# Altium schematic sheet Gigabit_Ethernet.SchDoc: Gigabit Ethernet
size A3; DrawnBy: Emre Can Damyanlı; Revision: A.1; SheetNumber: 9; SheetTotal: 9; ENG_APP_DATE: --/--/--; DSN_APP_DATE: --/--/--; CHK_APP_DATE: --/--/--
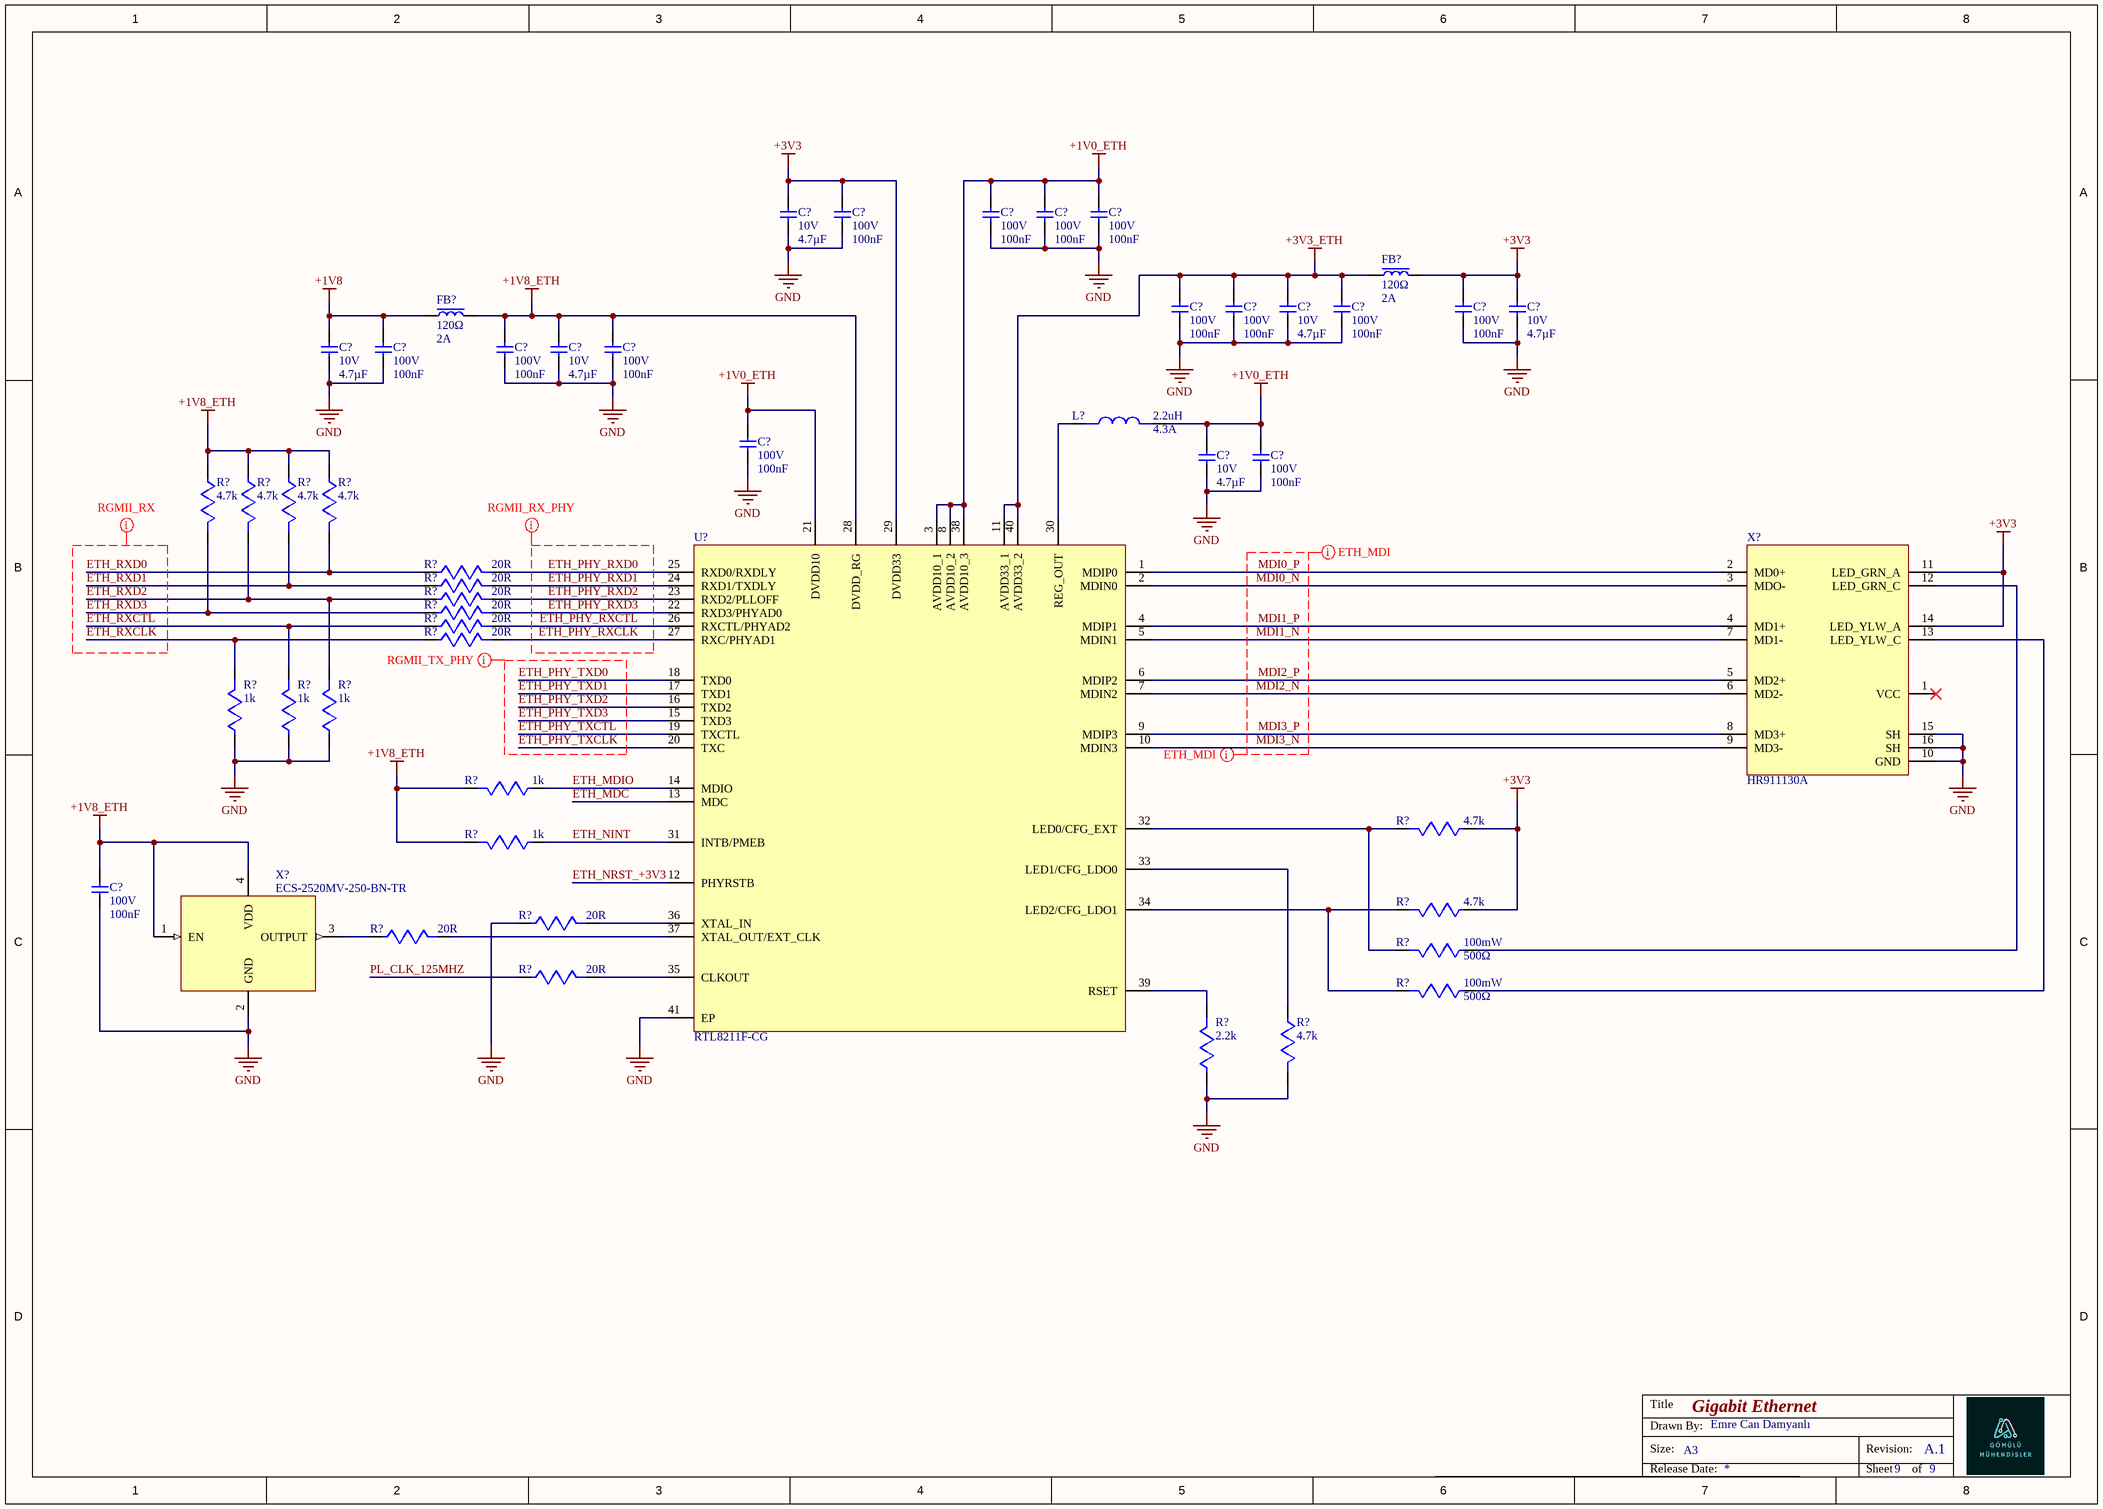
[diagram p0: Gigabit_Ethernet.SchDoc]

## Parts
(Parts that share a designator on the sheet are numbered #1, #2 ... from top to bottom, then left to right.)
C?#1  value 100nF  Voltage Rating: 100V  [CAPC1608X94N]  (hidden comment: GCJ188R72A104KA01D)
C?#2  value 100nF  Voltage Rating: 100V  [CAPC1608X94N]  (hidden comment: GCJ188R72A104KA01D)
C?#3  value 100nF  Voltage Rating: 100V  [CAPC1608X94N]  (hidden comment: GCJ188R72A104KA01D)
C?#4  value 100nF  Voltage Rating: 100V  [CAPC1608X94N]  (hidden comment: GCJ188R72A104KA01D)
C?#5  value 4.7µF  Voltage Rating: 10V  [CAPC1005X55N]  (hidden comment: CL05A475MP5NRNC)
C?#6  value 100nF  Voltage Rating: 100V  [CAPC1608X94N]  (hidden comment: GCJ188R72A104KA01D)
C?#7  value 100nF  Voltage Rating: 100V  [CAPC1608X94N]  (hidden comment: GCJ188R72A104KA01D)
C?#8  value 100nF  Voltage Rating: 100V  [CAPC1608X94N]  (hidden comment: GCJ188R72A104KA01D)
C?#9  value 100nF  Voltage Rating: 100V  [CAPC1608X94N]  (hidden comment: GCJ188R72A104KA01D)
C?#10  value 4.7µF  Voltage Rating: 10V  [CAPC1005X55N]  (hidden comment: CL05A475MP5NRNC)
C?#11  value 4.7µF  Voltage Rating: 10V  [CAPC1005X55N]  (hidden comment: CL05A475MP5NRNC)
C?#12  value 100nF  Voltage Rating: 100V  [CAPC1608X94N]  (hidden comment: GCJ188R72A104KA01D)
C?#13  value 100nF  Voltage Rating: 100V  [CAPC1608X94N]  (hidden comment: GCJ188R72A104KA01D)
C?#14  value 100nF  Voltage Rating: 100V  [CAPC1608X94N]  (hidden comment: GCJ188R72A104KA01D)
C?#15  value 4.7µF  Voltage Rating: 10V  [CAPC1005X55N]  (hidden comment: CL05A475MP5NRNC)
C?#16  value 4.7µF  Voltage Rating: 10V  [CAPC1005X55N]  (hidden comment: CL05A475MP5NRNC)
C?#17  value 100nF  Voltage Rating: 100V  [CAPC1608X94N]  (hidden comment: GCJ188R72A104KA01D)
C?#18  value 100nF  Voltage Rating: 100V  [CAPC1608X94N]  (hidden comment: GCJ188R72A104KA01D)
C?#19  value 4.7µF  Voltage Rating: 10V  [CAPC1005X55N]  (hidden comment: CL05A475MP5NRNC)
C?#20  value 100nF  Voltage Rating: 100V  [CAPC1608X94N]  (hidden comment: GCJ188R72A104KA01D)
FB?#1  Impedance: 120Ω  Max Current Rating: 2A  [FERRITE_0402]  (hidden comment: BLM15PX121SN1D)
FB?#2  Impedance: 120Ω  Max Current Rating: 2A  [FERRITE_0402]  (hidden comment: BLM15PX121SN1D)
L?  value 2.2uH  RMS Current (Irms): 4.3A  [PA4332.XXXNLT]  (hidden comment: PA4332.222NLT)
R?#1  value 4.7k  [RESISTOR_0603]  (hidden comment: RC0603FR-074K7L)
R?#2  value 4.7k  [RESISTOR_0603]  (hidden comment: RC0603FR-074K7L)
R?#3  value 4.7k  [RESISTOR_0603]  (hidden comment: RC0603FR-074K7L)
R?#4  value 4.7k  [RESISTOR_0603]  (hidden comment: RC0603FR-074K7L)
R?#5  value 20R  (hidden comment: RC0603FR-0720RL)
R?#6  value 20R  (hidden comment: RC0603FR-0720RL)
R?#7  value 20R  (hidden comment: RC0603FR-0720RL)
R?#8  value 20R  (hidden comment: RC0603FR-0720RL)
R?#9  value 20R  (hidden comment: RC0603FR-0720RL)
R?#10  value 20R  (hidden comment: RC0603FR-0720RL)
R?#11  value 1k  [RESISTOR_0603]  (hidden comment: RC0603FR-071KL)
R?#12  value 1k  [RESISTOR_0603]  (hidden comment: RC0603FR-071KL)
R?#13  value 1k  [RESISTOR_0603]  (hidden comment: RC0603FR-071KL)
R?#14  value 1k  [RESISTOR_0603]  (hidden comment: RC0603FR-071KL)
R?#15  value 4.7k  [RESISTOR_0603]  (hidden comment: RC0603FR-074K7L)
R?#16  value 1k  [RESISTOR_0603]  (hidden comment: RC0603FR-071KL)
R?#17  value 4.7k  [RESISTOR_0603]  (hidden comment: RC0603FR-074K7L)
R?#18  value 20R  (hidden comment: RC0603FR-0720RL)
R?#19  value 20R  (hidden comment: RC0603FR-0720RL)
R?#20  value 500Ω  Power Rating: 100mW  [RESISTOR_0603]  (hidden comment: RT0603BRC07500RL)
R?#21  value 20R  (hidden comment: RC0603FR-0720RL)
R?#22  value 500Ω  Power Rating: 100mW  [RESISTOR_0603]  (hidden comment: RT0603BRC07500RL)
R?#23  value 2.2k  [RESISTOR_0603]  (hidden comment: RC0603FR-072K2L)
R?#24  value 4.7k  [RESISTOR_0603]  (hidden comment: RC0603FR-074K7L)
U?  RTL8211F-CG  [QFN40P500X500X90-41N-D]
X?#1  HR911130A  [HR911130A]
X?#2  ECS-2520MV-250-BN-TR  [OSCCC250X200X90N]

## Nets
+1V0_ETH: C?#2.2 C?#3.2 C?#4.2 C?#17.2 C?#18.2 C?#19.2 L?.2 U?.3(AVDD10_1) U?.8(AVDD10_2) U?.21(DVDD10) U?.38(AVDD10_3)
+1V8: C?#12.2 C?#15.2 FB?#2.1
+1V8_ETH: C?#13.2 C?#14.2 C?#16.2 C?#20.2 FB?#2.2 R?#1.1 R?#2.1 R?#3.1 R?#4.1 R?#14.2 R?#16.2 U?.28(DVDD_RG) X?#2.1(EN) X?#2.4(VDD)
+3V3: C?#1.2 C?#5.2 C?#9.2 C?#11.2 FB?#1.1 R?#15.1 R?#17.1 U?.29(DVDD33) X?#1.11(LED_GRN_A) X?#1.14(LED_YLW_A)
+3V3_ETH: C?#6.2 C?#7.2 C?#8.2 C?#10.2 FB?#1.2 U?.11(AVDD33_1) U?.40(AVDD33_2)
GND: C?#1.1 C?#2.1 C?#3.1 C?#4.1 C?#5.1 C?#6.1 C?#7.1 C?#8.1 C?#9.1 C?#10.1 C?#11.1 C?#12.1 C?#13.1 C?#14.1 C?#15.1 C?#16.1 C?#17.1 C?#18.1 C?#19.1 C?#20.1 R?#11.1 R?#12.1 R?#13.1 R?#18.1 R?#23.1 R?#24.2 U?.41(EP) X?#1.10(GND) X?#1.15(SH) X?#1.16(SH) X?#2.2(GND)
ETH_MDC: U?.13(MDC)
ETH_MDIO: R?#14.1 U?.14(MDIO)
ETH_NINT: R?#16.1 U?.31(INTB/PMEB)
ETH_NRST_+3V3: U?.12(PHYRSTB)
ETH_PHY_RXCLK: R?#10.2 U?.27(RXC/PHYAD1)
ETH_PHY_RXCTL: R?#9.2 U?.26(RXCTL/PHYAD2)
ETH_PHY_RXD0: R?#5.2 U?.25(RXD0/RXDLY)
ETH_PHY_RXD1: R?#6.2 U?.24(RXD1/TXDLY)
ETH_PHY_RXD2: R?#7.2 U?.23(RXD2/PLLOFF)
ETH_PHY_RXD3: R?#8.2 U?.22(RXD3/PHYAD0)
ETH_PHY_TXCLK: U?.20(TXC)
ETH_PHY_TXCTL: U?.19(TXCTL)
ETH_PHY_TXD0: U?.18(TXD0)
ETH_PHY_TXD1: U?.17(TXD1)
ETH_PHY_TXD2: U?.16(TXD2)
ETH_PHY_TXD3: U?.15(TXD3)
ETH_RXCLK: R?#10.1 R?#11.2
ETH_RXCTL: R?#9.1 R?#12.2
ETH_RXD0: R?#4.2 R?#5.1
ETH_RXD1: R?#3.2 R?#6.1
ETH_RXD2: R?#2.2 R?#7.1 R?#13.2
ETH_RXD3: R?#1.2 R?#8.1
MDI0_N: U?.2(MDIN0) X?#1.3(MDO-)
MDI0_P: U?.1(MDIP0) X?#1.2(MD0+)
MDI1_N: U?.5(MDIN1) X?#1.7(MD1-)
MDI1_P: U?.4(MDIP1) X?#1.4(MD1+)
MDI2_N: U?.7(MDIN2) X?#1.6(MD2-)
MDI2_P: U?.6(MDIP2) X?#1.5(MD2+)
MDI3_N: U?.10(MDIN3) X?#1.9(MD3-)
MDI3_P: U?.9(MDIP3) X?#1.8(MD3+)
PL_CLK_125MHZ: R?#21.1
NetL?_1: L?.1 U?.30(REG_OUT)
NetR?#15_2: R?#15.2 R?#20.2 U?.32(LED0/CFG_EXT)
NetR?#17_2: R?#17.2 R?#22.2 U?.34(LED2/CFG_LDO1)
NetR?#18_2: R?#18.2 U?.36(XTAL_IN)
NetR?#19_1: R?#19.1 X?#2.3(OUTPUT)
NetR?#19_2: R?#19.2 U?.37(XTAL_OUT/EXT_CLK)
NetR?#20_1: R?#20.1 X?#1.12(LED_GRN_C)
NetR?#21_2: R?#21.2 U?.35(CLKOUT)
NetR?#22_1: R?#22.1 X?#1.13(LED_YLW_C)
NetR?#23_2: R?#23.2 U?.39(RSET)
NetR?#24_1: R?#24.1 U?.33(LED1/CFG_LDO0)

Not connected (* = marked no-connect by the designer): X?#1 1(VCC)*

## Layout directives
mark named ETH_MDI: MDI0_N, MDI0_P, MDI1_N, MDI1_P, MDI2_N, MDI2_P, MDI3_N, MDI3_P
differential pair: MDI0_N, MDI0_P, MDI1_N, MDI1_P, MDI2_N, MDI2_P, MDI3_N, MDI3_P
mark named RGMII_RX: ETH_RXCLK, ETH_RXCTL, ETH_RXD0, ETH_RXD1, ETH_RXD2, ETH_RXD3
mark named RGMII_RX_PHY: ETH_PHY_RXCLK, ETH_PHY_RXCTL, ETH_PHY_RXD0, ETH_PHY_RXD1, ETH_PHY_RXD2, ETH_PHY_RXD3
mark named RGMII_TX_PHY: ETH_PHY_TXCLK, ETH_PHY_TXCTL, ETH_PHY_TXD0, ETH_PHY_TXD1, ETH_PHY_TXD2, ETH_PHY_TXD3

## Notes on the sheet
- Title
- Size:
- Drawn By:
- A3
- Revision:
- Release Date:
- Sheet
- of

## Library data of the parts
C?#1-C?#4 C?#6-C?#9 C?#12-C?#14 C?#17 C?#18 C?#20 = GCJ188R72A104KA01D: Cap Ceramic 0.1uF 100V X7R 10% Pad SMD 0603 Soft Termination 125C Automotive T/R; Manufacturer: Murata; Material: 4241ConductorMaterial; Supplier: Digikey; Supplier Part Number: 490-13420-1-ND; Manufacturer Part Number: GCJ188R72A104KA01D; RoHS: Yes; Category: Ceramic Capacitors; Stock: 681954; Pricing: 1=0,19, 10=0,123, 50=0,0774, 100=0,0619, 500=0,04472, 1000=0,03956 (USD); Mounting Technology: Surface Mount; Case/Package: 0603; Case Code (Metric): 1608; Case Code (Imperial): 0603; Min Operating Temperature: -55°C; Max Operating Temperature: 125°C; Packaging: Cut Tape; Tolerance: 10%; Features: Soft Termination; Series: GCJ; Length: 0.063inch; Width: 0.031inch; Height: 900um; Thickness: 0.035inch; Ratings: AEC-Q200; RoHS Compliant: Yes; Lead Free: 5697LeadFree; ComponentLink1URL: https://datasheet.octopart.com/GCJ188R72A104KA01D-Murata-datasheet-78375067.pdf?src-supplier=Future+Electronics; ComponentLink1Description: https://datasheet.octopart.com/GCJ188R72A104KA01D-Murata-datasheet-78375067.pdf?src-supplier=Future+Electronics; ComponentLink2URL: http://search.murata.co.jp/Ceramy/image/img/A01X/partnumbering_e_02.pdf?src-supplier=Digikey; ComponentLink2Description: http://search.murata.co.jp/Ceramy/image/img/A01X/partnumbering_e_02.pdf?src-supplier=Digikey; ComponentLink3URL: https://www.murata.com/~/media/webrenewal/support/library/catalog/products/capacitor/mlcc/c03e.ashx?la=en-us&src-supplier=Digikey; ComponentLink3Description: https://www.murata.com/~/media/webrenewal/support/library/catalog/products/capacitor/mlcc/c03e.ashx?la=en-us&src-supplier=Digikey; ComponentLink4URL: https://datasheet.octopart.com/GCJ188R72A104KA01D-Murata-datasheet-165611796.pdf?src-supplier=TME; ComponentLink4Description: https://datasheet.octopart.com/GCJ188R72A104KA01D-Murata-datasheet-165611796.pdf?src-supplier=TME
C?#5 C?#10 C?#11 C?#15 C?#16 C?#19 = CL05A475MP5NRNC: Ceramic Capacitor, Multilayer, Ceramic, 10V, 20% +Tol, 20% -Tol, X5R, +-15% TC, 4.7uF, Surface Mount, 0402 inch; Manufacturer: Samsung Electro-Mechanics; Supplier: Avnet; Supplier Part Number: CL05A475MP5NRNC; Manufacturer Part Number: CL05A475MP5NRNC; RoHS: Compliant; Category: Ceramic Capacitors; Stock: 40000; Pricing: 10000=0,00671, 20000=0,00663, 40000=0,0066, 80000=0,00656, 160000=0,00653 (USD); Case/Package: 0402; Case Code (Imperial): 0402; Case Code (Metric): 1005; China RoHS: Compliant; Dielectric: X5R; Dielectric Material: Ceramic; Height: 500µm; Lead Free: Lead Free; Length: 1mm; Lifecycle Status: Production; Material: Ceramic; Max Operating Temperature: 85°C; Min Operating Temperature: -55°C; Mounting Technology: Surface Mount; Number of Terminals: 2; REACH SVHC: Yes; Schedule B: 8532240020, 8532240020|8532240020|8532240020|8532240020|8532240020|8532240020|8532240020|8532240020|8532240020|8532240020|8532240020|8532240020|8532240020|8532240020|8532240020|8532240020|8532240020|8532240020|8532240020|8532240020|8532240020|8532240020, 8532240020|8532240020|8532240020|8532240020|8532240020|8532240020|8532240020|8532240020|8532240020|8532240020|8532240020|8532240020|8532240020|8532240020|8532240020|8532240020|8532240020|8532240020|8532240020|8532240020|8532240020|8532240020|8532240020, 8532240020|8532240020|8532240020|8532240020|8532240020|8532240020|8532240020|8532240020|8532240020|8532240020|8532240020|8532240020|8532240020|8532240020|8532240020|8532240020|8532240020|8532240020|8532240020|8532240020|8532240020|8532240020|8532240020|85; Thickness: 558.8µm; Tolerance: 20%; Voltage Rating (DC): 10V; Width: 500µm; ComponentLink1URL: https://datasheet.octopart.com:443/CL05A475MP5NRNC-Samsung-Electro-Mechanics-datasheet-181551186.pdf?src-supplier=Newark; ComponentLink1Description: https://datasheet.octopart.com:443/CL05A475MP5NRNC-Samsung-Electro-Mechanics-datasheet-181551186.pdf?src-supplier=Newark; ComponentLink2URL: https://datasheet.octopart.com:443/CL05A475MP5NRNC-Samsung-Electro-Mechanics-datasheet-136482298.pdf?src-supplier=Newark; ComponentLink2Description: https://datasheet.octopart.com:443/CL05A475MP5NRNC-Samsung-Electro-Mechanics-datasheet-136482298.pdf?src-supplier=Newark; ComponentLink3URL: https://datasheet.octopart.com:443/CL05A475MP5NRNC-Samsung-Electro-Mechanics-datasheet-136031736.pdf?src-supplier=Future+Electronics; ComponentLink3Description: https://datasheet.octopart.com:443/CL05A475MP5NRNC-Samsung-Electro-Mechanics-datasheet-136031736.pdf?src-supplier=Future+Electronics; ComponentLink4URL: https://datasheet.octopart.com:443/CL05A475MP5NRNC-Samsung-Electro-Mechanics-datasheet-110226226.pdf?src-supplier=Future+Electronics; ComponentLink4Description: https://datasheet.octopart.com:443/CL05A475MP5NRNC-Samsung-Electro-Mechanics-datasheet-110226226.pdf?src-supplier=Future+Electronics; ComponentLink5URL: https://datasheet.octopart.com:443/CL05A475MP5NRNC-Samsung-Electro-Mechanics-datasheet-87580058.pdf?src-supplier=Future+Electronics; ComponentLink5Description: https://datasheet.octopart.com:443/CL05A475MP5NRNC-Samsung-Electro-Mechanics-datasheet-87580058.pdf?src-supplier=Future+Electronics; ComponentLink6URL: https://datasheet.octopart.com:443/CL05A475MP5NRNC-Samsung-Electro-Mechanics-datasheet-81461611.pdf?src-supplier=Future+Electronics; ComponentLink6Description: https://datasheet.octopart.com:443/CL05A475MP5NRNC-Samsung-Electro-Mechanics-datasheet-81461611.pdf?src-supplier=Future+Electronics; ComponentLink7URL: https://datasheet.octopart.com:443/CL05A475MP5NRNC-Samsung-datasheet-48647200.pdf?src-supplier=Future+Electronics; ComponentLink7Description: https://datasheet.octopart.com:443/CL05A475MP5NRNC-Samsung-datasheet-48647200.pdf?src-supplier=Future+Electronics; ComponentLink8URL: https://datasheet.octopart.com:443/CL05A475MP5NRNC-Samsung-datasheet-34153549.pdf?src-supplier=Future+Electronics; ComponentLink8Description: https://datasheet.octopart.com:443/CL05A475MP5NRNC-Samsung-datasheet-34153549.pdf?src-supplier=Future+Electronics; ComponentLink9URL: https://datasheet.octopart.com:443/CL05A475MP5NRNC-Samsung-datasheet-26589015.pdf?src-supplier=Future+Electronics; ComponentLink9Description: https://datasheet.octopart.com:443/CL05A475MP5NRNC-Samsung-datasheet-26589015.pdf?src-supplier=Future+Electronics; ComponentLink10URL: https://datasheet.octopart.com:443/CL05A475MP5NRNC-Samsung-datasheet-8324245.pdf?src-supplier=Future+Electronics; ComponentLink10Description: https://datasheet.octopart.com:443/CL05A475MP5NRNC-Samsung-datasheet-8324245.pdf?src-supplier=Future+Electronics; ComponentLink11URL: https://datasheet.octopart.com:443/CL05A475MP5NRNC-Samsung-Electro-Mechanics-datasheet-149136695.pdf?src-supplier=Future+Electronics; ComponentLink11Description: https://datasheet.octopart.com:443/CL05A475MP5NRNC-Samsung-Electro-Mechanics-datasheet-149136695.pdf?src-supplier=Future+Electronics; ComponentLink12URL: https://datasheet.octopart.com:443/CL05A475MP5NRNC-Samsung-datasheet-8326407.pdf?src-supplier=TME; ComponentLink12Description: https://datasheet.octopart.com:443/CL05A475MP5NRNC-Samsung-datasheet-8326407.pdf?src-supplier=TME
FB?#1 FB?#2 = BLM15PX121SN1D: Ferrite Beads Multi-Layer 120Ohm 25% 100MHz 2A 0.055Ohm DCR 0402 T/R; Manufacturer: Murata; Current Rating: 1.1A; DC Resistance (DCR): 55mΩ; Material: Steel; Number of Circuits: 1; Supplier: Arrow Electronics; Supplier Part Number: BLM15PX121SN1D; Manufacturer Part Number: BLM15PX121SN1D; RoHS: Compliant; Category: Ferrite Beads and Chips; Stock: 81241; Pricing: 4237=0,0236, 6000=0,023, 15000=0,023, 30000=0,022, 75000=0,022 (USD); Case/Package: 0402; Case Code (Imperial): 0402; Case Code (Metric): 1005; Contact Plating: Tin; Core Material: Ferrite; Height: 500µm; Lead Free: Lead Free; Length: 1mm; Lifecycle Status: Production; Max DC Current: 2A; Max Operating Temperature: 125°C; Min Operating Temperature: -55°C; Number of Lines: 1; Pins: 2; Number of Terminals: 2; Packaging: Tape and Reel; REACH SVHC: Yes; RMS Current (Irms): 2A; Schedule B: 8504500000, 8504500000|8504500000, 8504500000|8504500000|8504500000, 8504500000|8504500000|8504500000|8504500000; ESR: 55mΩ; Termination: SMD/SMT; Test Frequency: 100MHz; Tolerance: 25%; Weight: 652.039032µg; Width: 500µm; ComponentLink1URL: https://datasheet.octopart.com:443/BLM15PX121SN1D-Murata-datasheet-180806543.pdf?src-supplier=IHS; ComponentLink1Description: https://datasheet.octopart.com:443/BLM15PX121SN1D-Murata-datasheet-180806543.pdf?src-supplier=IHS; ComponentLink2URL: https://datasheet.octopart.com:443/BLM15PX121SN1D-Murata-datasheet-12522583.pdf?src-supplier=Upverter; ComponentLink2Description: https://datasheet.octopart.com:443/BLM15PX121SN1D-Murata-datasheet-12522583.pdf?src-supplier=Upverter; ComponentLink3URL: https://datasheet.octopart.com:443/BLM15PX121SN1D-Murata-datasheet-10083551.pdf?src-supplier=Upverter; ComponentLink3Description: https://datasheet.octopart.com:443/BLM15PX121SN1D-Murata-datasheet-10083551.pdf?src-supplier=Upverter; ComponentLink4URL: https://datasheet.octopart.com:443/BLM15PX121SN1D-Murata-datasheet-8508678.pdf?src-supplier=Upverter; ComponentLink4Description: https://datasheet.octopart.com:443/BLM15PX121SN1D-Murata-datasheet-8508678.pdf?src-supplier=Upverter; ComponentLink5URL: https://datasheet.octopart.com:443/BLM15PX121SN1D-Murata-datasheet-39128427.pdf?src-supplier=Newark; ComponentLink5Description: https://datasheet.octopart.com:443/BLM15PX121SN1D-Murata-datasheet-39128427.pdf?src-supplier=Newark; ComponentLink6URL: https://datasheet.octopart.com:443/BLM15PX121SN1D-Murata-datasheet-166171473.pdf?src-supplier=TME; ComponentLink6Description: https://datasheet.octopart.com:443/BLM15PX121SN1D-Murata-datasheet-166171473.pdf?src-supplier=TME; ComponentLink7URL: https://datasheet.octopart.com:443/BLM15PX121SN1D-Murata-datasheet-141257890.pdf?src-supplier=Ciiva; ComponentLink7Description: https://datasheet.octopart.com:443/BLM15PX121SN1D-Murata-datasheet-141257890.pdf?src-supplier=Ciiva; ComponentLink8URL: https://datasheet.octopart.com:443/BLM15PX121SN1D-Murata-datasheet-138706708.pdf?src-supplier=Ciiva; ComponentLink8Description: https://datasheet.octopart.com:443/BLM15PX121SN1D-Murata-datasheet-138706708.pdf?src-supplier=Ciiva; ComponentLink9URL: https://datasheet.octopart.com:443/BLM15PX121SN1D-Murata-datasheet-78375072.pdf?src-supplier=Future+Electronics; ComponentLink9Description: https://datasheet.octopart.com:443/BLM15PX121SN1D-Murata-datasheet-78375072.pdf?src-supplier=Future+Electronics; ComponentLink10URL: https://datasheet.octopart.com:443/BLM15PX121SN1D-Murata-datasheet-13563506.pdf?src-supplier=Future+Electronics; ComponentLink10Description: https://datasheet.octopart.com:443/BLM15PX121SN1D-Murata-datasheet-13563506.pdf?src-supplier=Future+Electronics; ComponentLink11URL: https://datasheet.octopart.com:443/BLM15PX121SN1D-Murata-datasheet-12545319.pdf?src-supplier=Future+Electronics; ComponentLink11Description: https://datasheet.octopart.com:443/BLM15PX121SN1D-Murata-datasheet-12545319.pdf?src-supplier=Future+Electronics; ComponentLink12URL: https://datasheet.octopart.com/BLM15PX121SN1D-Murata-datasheet-37129980.pdf; ComponentLink12Description: https://datasheet.octopart.com/BLM15PX121SN1D-Murata-datasheet-37129980.pdf; ComponentLink13URL: http://sigma.octopart.com:80/reach_statement/Murata-company-16.pdf?src-supplier=Compliance+Statements; ComponentLink13Description: http://sigma.octopart.com:80/reach_statement/Murata-company-16.pdf?src-supplier=Compliance+Statements
L? = PA4332.222NLT: PA4332 SMT Shielded Drum Core Inductor Series, up to 5.8A, 2.0mm Max Height; Manufacturer: Pulse; ESR: 48mR; Supplier: Digikey; Supplier Part Number: 553-3290-1-ND; Manufacturer Part Number: PA4332.222NLT; RoHS: Yes; Category: Fixed Inductors; Stock: 54159; Pricing: 1=0,56, 10=0,477, 25=0,4376, 50=0,3976, 100=0,3539, 250=0,33404, 500=0,28634, 1000=0,25452 (USD); Height: 2mm; ComponentLink1URL: http://products.pulseelex.com/files/product_files/P761.pdf?src-supplier=Digikey; ComponentLink1Description: http://products.pulseelex.com/files/product_files/P761.pdf?src-supplier=Digikey; ComponentLink2URL: https://datasheet.octopart.com/PA4332.222NLT-Pulse-datasheet-137333238.pdf?src-supplier=Electro+Sonic; ComponentLink2Description: https://datasheet.octopart.com/PA4332.222NLT-Pulse-datasheet-137333238.pdf?src-supplier=Electro+Sonic
R?#1-R?#4 R?#15 R?#17 R?#24 = RC0603FR-074K7L: SMD Chip Resistor, 4.7 kOhm, ± 1%, 100 mW, 0603 [1608 Metric], Thick Film, General Purpose; Manufacturer: Yageo; Power Rating: 100mW; Voltage Rating (DC): 50V; Temperature Coefficient: 100ppm/°C; Supplier: Digi-Key; Supplier Part Number: 311-4.70KHRCT-ND; Manufacturer Part Number: RC0603FR-074K7L; RoHS: Yes; Category: Chip SMD Resistors; Stock: 7233601; Pricing: 1=0,1, 10=0,018, 50=0,0106, 100=0,0088, 500=0,00592, 1000=0,00505 (USD); Case/Package: 0603; Pins: 2; Case Code (Imperial): 0603; Case Code (Metric): 1608; Min Operating Temperature: -55°C; Max Operating Temperature: 155°C; Tolerance: 1%; Resistor Type: Thick Film; Packaging: Tape and Reel; Voltage Rating: 50V; Termination: SMD/SMT; Features: Moisture Resistant; Series: RC; Max Power Dissipation: 100mW; Number of Terminations: 2; Construction: Rectangular; Resistance Tolerance: 1%; Length: 1.6mm; Width: 0.8mm; Depth: 0.8mm; Lead Pitch: 0.3mm; Lead Free: Lead Free; Reach SVHC Compliant: Unknown; RoHS Compliant: Yes; Military Standard: Not; ComponentLink1URL: https://datasheet.ciiva.com/15189/getdatasheetpartid-422754-15189760.pdf?src-supplier=Verical; ComponentLink1Description: https://datasheet.ciiva.com/15189/getdatasheetpartid-422754-15189760.pdf?src-supplier=Verical; ComponentLink2URL: https://datasheet.ciiva.com/7660/38590-7660794.pdf?src-supplier=Element14; ComponentLink2Description: https://datasheet.ciiva.com/7660/38590-7660794.pdf?src-supplier=Element14; ComponentLink3URL: https://datasheet.ciiva.com/22747/443971-22747528.pdf?src-supplier=Element14; ComponentLink3Description: https://datasheet.ciiva.com/22747/443971-22747528.pdf?src-supplier=Element14; ComponentLink4URL: https://datasheet.ciiva.com/46440/1868787-46440909.pdf?src-supplier=Element14; ComponentLink4Description: https://datasheet.ciiva.com/46440/1868787-46440909.pdf?src-supplier=Element14; ComponentLink5URL: https://datasheet.ciiva.com/7746/1868787-7746365.pdf?src-supplier=Element14; ComponentLink5Description: https://datasheet.ciiva.com/7746/1868787-7746365.pdf?src-supplier=Element14; ComponentLink6URL: https://datasheet.ciiva.com/7746/1738695-7746366.pdf?src-supplier=Element14; ComponentLink6Description: https://datasheet.ciiva.com/7746/1738695-7746366.pdf?src-supplier=Element14
R?#5-R?#10 R?#18 R?#19 R?#21 = RC0603FR-0720RL: SMD Chip Resistor, 20 Ohm, ± 1%, 100 mW, 0603 [1608 Metric], Thick Film, General Purpose; Manufacturer: Yageo; Power Rating: 100mW; Voltage Rating: 50V; Temperature Coefficient: 100ppm/°C; Working Voltage: 75V; Supplier: Digi-Key; Supplier Part Number: 311-20.0HRCT-ND; Manufacturer Part Number: RC0603FR-0720RL; RoHS: Yes; Category: Chip SMD Resistors; Stock: 293682; Pricing: 1=0,1, 10=0,018, 50=0,0106, 100=0,0088, 500=0,00592, 1000=0,00505 (USD); Case/Package: 0603; Case Code (Imperial): 0603; Case Code (Metric): 1608; Min Operating Temperature: -55°C; Max Operating Temperature: 155°C; Tolerance: 1%; Packaging: Tape and Reel; Package Quantity: 5000; Termination: SMD/SMT; Resistor Type: Thick Film; Number of Terminations: 2; Max Power Dissipation: 100mW; Voltage Rating (DC): 50V; Features: Moisture Resistant; Series: RC; Construction: Rectangular; Technology: THICK FILM; Resistance Tolerance: 1%; Length: 1.6mm; Width: 0.031inch; Height: 0.45mm; Depth: 0.8mm; Reach SVHC Compliant: No; Military Standard: Not; Lead Free: Lead Free; RoHS Compliant: Yes; ComponentLink1URL: https://datasheet.ciiva.com/11819/0900766b80f96399-11819290.pdf?src-supplier=Rs; ComponentLink1Description: https://datasheet.ciiva.com/11819/0900766b80f96399-11819290.pdf?src-supplier=Rs; ComponentLink2URL: https://datasheet.ciiva.com/46395/443971-46395031.pdf?src-supplier=Element14; ComponentLink2Description: https://datasheet.ciiva.com/46395/443971-46395031.pdf?src-supplier=Element14; ComponentLink3URL: https://datasheet.ciiva.com/2454/pyu-r-int-thick-7-2454028.pdf?src-supplier=Digi-Key; ComponentLink3Description: https://datasheet.ciiva.com/2454/pyu-r-int-thick-7-2454028.pdf?src-supplier=Digi-Key; ComponentLink4URL: https://datasheet.ciiva.com/2454/pyu-r-int-thick-7-2454029.pdf?src-supplier=Digi-Key; ComponentLink4Description: https://datasheet.ciiva.com/2454/pyu-r-int-thick-7-2454029.pdf?src-supplier=Digi-Key; ComponentLink5URL: https://datasheet.ciiva.com/2454/pyu-r-int-thick-7-2454027.pdf?src-supplier=Digi-Key; ComponentLink5Description: https://datasheet.ciiva.com/2454/pyu-r-int-thick-7-2454027.pdf?src-supplier=Digi-Key; ComponentLink6URL: https://datasheet.ciiva.com/12557/rc0603-272842-12557941.pdf?src-supplier=Mouser; ComponentLink6Description: https://datasheet.ciiva.com/12557/rc0603-272842-12557941.pdf?src-supplier=Mouser; ComponentLink7URL: https://datasheet.ciiva.com/15189/getdatasheetpartid-324013-15189653.pdf?src-supplier=Verical; ComponentLink7Description: https://datasheet.ciiva.com/15189/getdatasheetpartid-324013-15189653.pdf?src-supplier=Verical
R?#11-R?#14 R?#16 = RC0603FR-071KL: SMD Chip Resistor, 1 kOhm, ± 1%, 100 mW, 0603 [1608 Metric], Thick Film, General Purpose; Manufacturer: Yageo; Temperature Coefficient: 100ppm/°C; Power Rating: 100mW; Voltage Rating: 50V; Supplier: Digi-Key; Supplier Part Number: 311-1.00KHRCT-ND; Manufacturer Part Number: RC0603FR-071KL; RoHS: Yes; Category: Chip SMD Resistors; Stock: 18662657; Pricing: 1=0,1, 10=0,018, 50=0,0106, 100=0,0088, 500=0,00592, 1000=0,00505 (USD); Case/Package: 0603; Contact Plating: Tin,Matte; Case Code (Imperial): 0603; Case Code (Metric): 1608; Min Operating Temperature: -55°C; Max Operating Temperature: 155°C; Tolerance: 1%; Resistor Type: Thick Film; Packaging: Tape and Reel; Termination: SMD/SMT; Features: Moisture Resistant; Series: RC; Max Power Dissipation: 100mW; Number of Terminations: 2; Technology: THICK FILM; Resistance Tolerance: 1%; Construction: Rectangular; Length: 1.6mm; Height: 0.45mm; Depth: 0.8mm; Reach SVHC Compliant: No; Military Standard: Not; RoHS Compliant: Yes
R?#20 R?#22 = RT0603BRC07500RL: Fixed Resistor, Thin Film, 0.1W, 500ohm, 75V, 0.1% +/-Tol, 15ppm/Cel, Surface Mount, 0603; Manufacturer: Yageo Group; Temperature Coefficient: 15ppm/°C; Supplier: Farnell; Supplier Part Number: 4152629; Manufacturer Part Number: RT0603BRC07500RL; RoHS: Compliant; Category: Chip SMD Resistors; Stock: 4870; Pricing: 5000=0,12 (EUR); Case/Package: 0603; China RoHS: Non-Compliant; Composition: Thin Film; Height: 450µm; Lifecycle Status: Production; Max Operating Temperature: 155°C; Min Operating Temperature: -55°C; Mounting Technology: Surface Mount; Number of Terminals: 2; Packaging: Tape & Reel; Power Dissipation: 100mW; REACH SVHC: Yes; Tolerance: 0.1%; Voltage Rating: 75V; Width: 800µm; Working Voltage: 75V; ComponentLink1URL: https://datasheet.octopart.com:443/RT0603BRC07500RL-Yageo-datasheet-176402239.pdf?src-supplier=IHS; ComponentLink1Description: https://datasheet.octopart.com:443/RT0603BRC07500RL-Yageo-datasheet-176402239.pdf?src-supplier=IHS; ComponentLink2URL: https://datasheet.octopart.com:443/RT0603BRC07500RL-Yageo-datasheet-141265893.pdf?src-supplier=ODG+(Origin+Data+Global); ComponentLink2Description: https://datasheet.octopart.com:443/RT0603BRC07500RL-Yageo-datasheet-141265893.pdf?src-supplier=ODG+(Origin+Data+Global); ComponentLink3URL: https://datasheet.octopart.com:443/RT0603BRC07500RL-Yageo-datasheet-169971040.pdf?src-supplier=Upverter; ComponentLink3Description: https://datasheet.octopart.com:443/RT0603BRC07500RL-Yageo-datasheet-169971040.pdf?src-supplier=Upverter; ComponentLink4URL: https://datasheet.octopart.com:443/RT0603BRC07500RL-Yageo-datasheet-166250672.pdf?src-supplier=Future+Electronics; ComponentLink4Description: https://datasheet.octopart.com:443/RT0603BRC07500RL-Yageo-datasheet-166250672.pdf?src-supplier=Future+Electronics; ComponentLink5URL: https://datasheet.octopart.com/RT0603BRC07500RL-Yageo-datasheet-86813807.pdf; ComponentLink5Description: https://datasheet.octopart.com/RT0603BRC07500RL-Yageo-datasheet-86813807.pdf; ComponentLink6URL: http://sigma.octopart.com:80/rohs_statement/Yageo-company-2.pdf?src-supplier=Compliance+Statements; ComponentLink6Description: http://sigma.octopart.com:80/rohs_statement/Yageo-company-2.pdf?src-supplier=Compliance+Statements; ComponentLink7URL: http://sigma.octopart.com:80/conflict_mineral_statement/Yageo-company-3.pdf?src-supplier=Compliance+Statements; ComponentLink7Description: http://sigma.octopart.com:80/conflict_mineral_statement/Yageo-company-3.pdf?src-supplier=Compliance+Statements
R?#23 = RC0603FR-072K2L: SMD Chip Resistor, 2.2 kOhm, ± 1%, 100 mW, 0603 [1608 Metric], Thick Film, General Purpose; Manufacturer: Yageo; Temperature Coefficient: 100ppm/°C; Power Rating: 100mW; Voltage Rating: 50V; Supplier: Digi-Key; Supplier Part Number: 311-2.20KHRCT-ND; Manufacturer Part Number: RC0603FR-072K2L; RoHS: Yes; Category: Chip SMD Resistors; Stock: 709886; Pricing: 1=0,1, 10=0,019, 50=0,0112, 100=0,0093, 500=0,00622, 1000=0,00532 (USD); Case/Package: 0603; Case Code (Imperial): 0603; Case Code (Metric): 1608; Min Operating Temperature: -55°C; Max Operating Temperature: 155°C; Tolerance: 1%; Packaging: Tape and Reel; Resistor Type: Thick Film; Number of Terminations: 2; Max Power Dissipation: 100mW; Features: Moisture Resistant; Series: RC; Resistance Tolerance: 1%; Lead Free: Lead Free; Reach SVHC Compliant: Unknown; RoHS Compliant: Yes
U? = RTL8211F-CG: Ethernet Transceiver RGMII WQFN-40-EP(5x5) Drivers, Receivers, Transceivers RoHS; Manufacturer Part Number: RTL8211F-CG
X?#1 = HR911130A: Jack Modular Connector RJ45 Through Hole; Manufacturer Part Number: HR911130A
X?#2 = ECS-2520MV-250-BN-TR: ECS-2520 Series 25 MHz 1.6 to 3.6 V ±50 ppm-40°C to 85°C SMT Crystal Oscillator; Manufacturer: ECS International; Body Material: Ceramic; Fall Time: 7ns; Frequency: 25MHz; Frequency Stability: 50ppm; Load Capacitance: 15pF; Max Supply Current: 7mA; Max Supply Voltage: 3.6V; Min Supply Voltage: 1.6V; Supplier: Future Electronics; Supplier Part Number: ECS-2520MV-250-BN-TR; Manufacturer Part Number: ECS-2520MV-250-BN-TR; RoHS: Compliant; Category: Crystals; Stock: 21000; Pricing: 3000=0,61 (USD); Introduction Date: 2018-03-21; Lifecycle Status: Production; Max Operating Temperature: 85°C; Min Operating Temperature: -40°C; Mounting Technology: Surface Mount; Number of Terminals: 4; REACH SVHC: Yes; Rise Time: 7ns; Schedule B: 8542310000, 8542310000|8542310000|8542310000|8542310000|8542310000|8542310000|8542310000|8542310000|8542310000|8542310000|8542310000|8542310000|8542310000|8542310000|8542310000|8542310000|8542310000|8542310000|8542310000|8542310000|8542310000|8542310000|8542310000|85, 8542390000; ComponentLink1URL: https://datasheet.octopart.com:443/ECS-2520MV-250-BN-TR-ECS-International-datasheet-179230857.pdf?src-supplier=IHS; ComponentLink1Description: https://datasheet.octopart.com:443/ECS-2520MV-250-BN-TR-ECS-International-datasheet-179230857.pdf?src-supplier=IHS; ComponentLink2URL: https://datasheet.octopart.com:443/ECS-2520MV-250-BN-TR-ECS-International-datasheet-104167383.pdf?src-supplier=Master+Electronics; ComponentLink2Description: https://datasheet.octopart.com:443/ECS-2520MV-250-BN-TR-ECS-International-datasheet-104167383.pdf?src-supplier=Master+Electronics; ComponentLink3URL: https://datasheet.octopart.com:443/ECS-2520MV-250-BN-TR-ECS-International-datasheet-189099886.pdf?src-supplier=Master+Electronics; ComponentLink3Description: https://datasheet.octopart.com:443/ECS-2520MV-250-BN-TR-ECS-International-datasheet-189099886.pdf?src-supplier=Master+Electronics; ComponentLink4URL: https://datasheet.octopart.com:443/ECS-2520MV-250-BN-TR-ECS-International-datasheet-138123782.pdf?src-supplier=Future+Electronics; ComponentLink4Description: https://datasheet.octopart.com:443/ECS-2520MV-250-BN-TR-ECS-International-datasheet-138123782.pdf?src-supplier=Future+Electronics